# Altium schematic sheet 12-6v.SchDoc
size A4
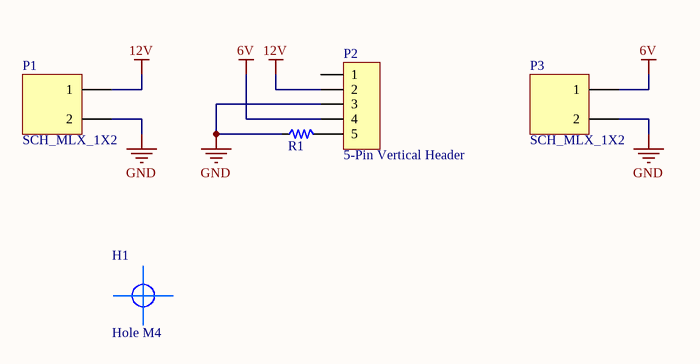
[diagram p0: 12-6v.SchDoc]

## Parts
H1  Hole M4  [#10Hole]
P1  SCH_MLX_1X2  [PCB_MLX_MICROFIT_1X2]
P2  5-Pin Vertical Header  [5-Pin Vertical Header]
P3  SCH_MLX_1X2  [PCB_MLX_MICROFIT_1X2]
R1  SCH_GENERIC_RESISTOR_0603  [PCB_GENERIC_SMD_0603]  (value not drawn)

## Nets
6V: P2.4 P3.1
12V: P1.1 P2.2
GND: P1.2 P2.3 P3.2 R1.1
NetP2_5: P2.5 R1.2

Not connected (* = marked no-connect by the designer): P2 1

## Library data of the parts
H1 = #10Hole
P2 = 5-Pin Vertical Header: Manufacturer: Sullins; Manufacturer No.: PPPC041LFBN-RC
R1 = SCH_GENERIC_RESISTOR_0603: Generic SMD resistor 0603; Resistance: *